# Altium schematic sheet PowerBoard.SchDoc: DriveHUB CardFrame - Backplane Power
size A3; Date: 01/08/22; Engineer: AJC; DocumentNumber: 35-735; Revision: D; SheetNumber: 1; SheetTotal: 3; Manager: AJC
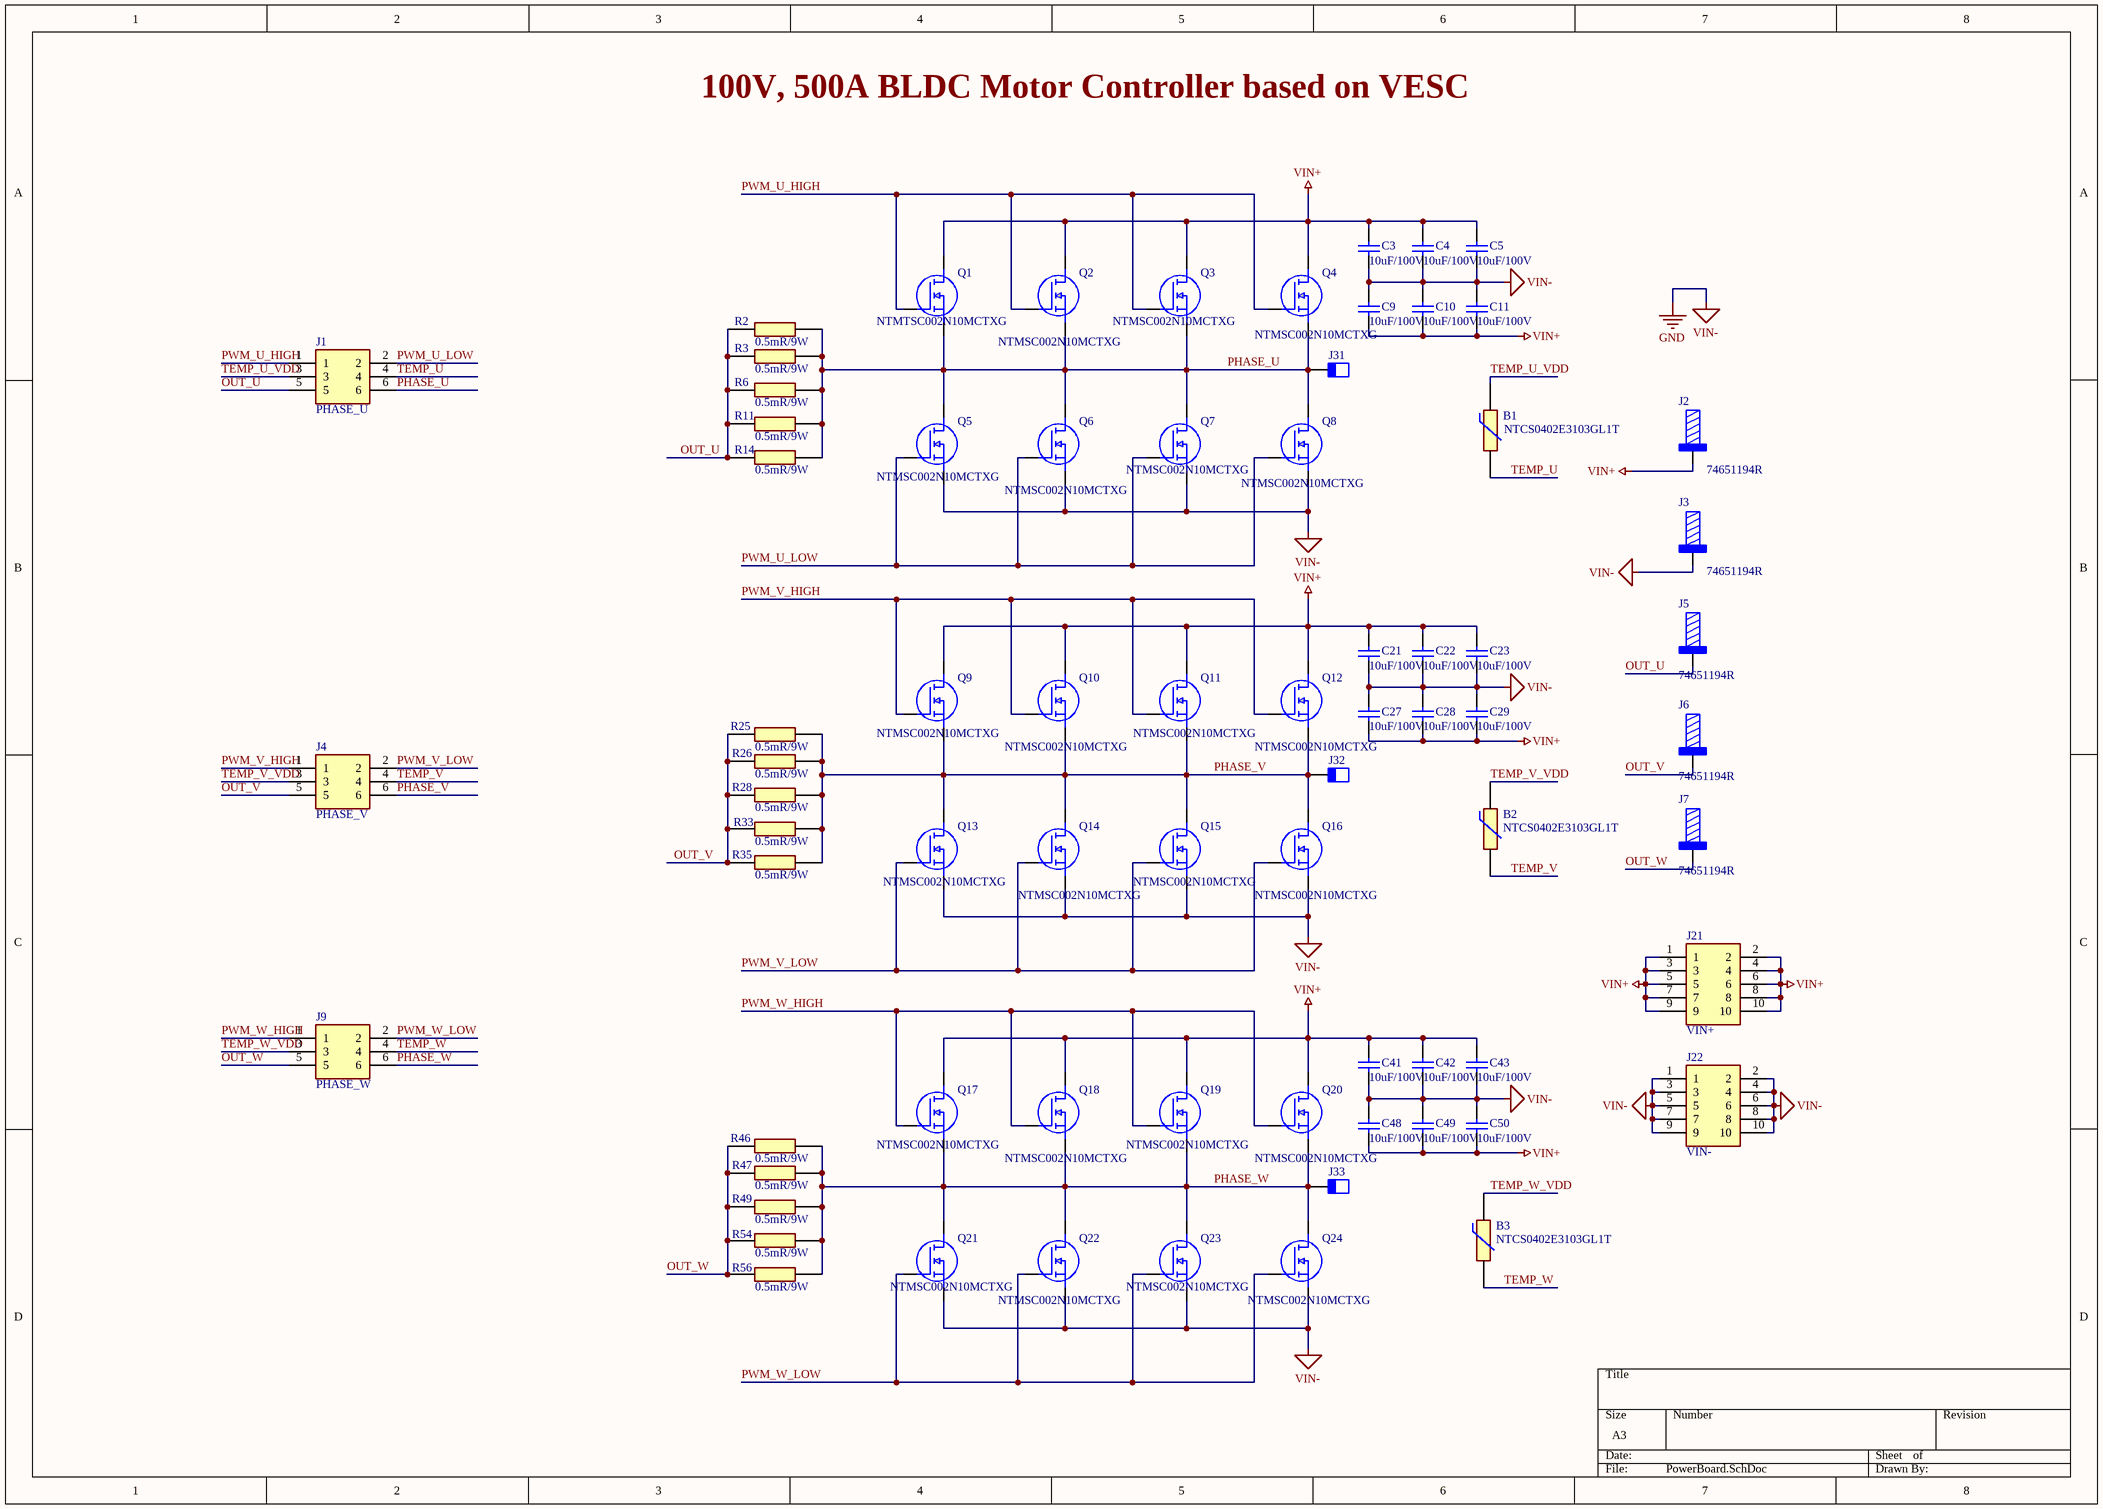
[diagram p0: PowerBoard.SchDoc]

## Parts
B1  NTCS0402E3103GL1T  [THRMC1005X65N]
B2  NTCS0402E3103GL1T  [THRMC1005X65N]
B3  NTCS0402E3103GL1T  [THRMC1005X65N]
C3  10uF/100V  [CAPC3225X230N]
C4  10uF/100V  [CAPC3225X230N]
C5  10uF/100V  [CAPC3225X230N]
C9  10uF/100V  [CAPC3225X230N]
C10  10uF/100V  [CAPC3225X230N]
C11  10uF/100V  [CAPC3225X230N]
C21  10uF/100V  [CAPC3225X230N]
C22  10uF/100V  [CAPC3225X230N]
C23  10uF/100V  [CAPC3225X230N]
C27  10uF/100V  [CAPC3225X230N]
C28  10uF/100V  [CAPC3225X230N]
C29  10uF/100V  [CAPC3225X230N]
C41  10uF/100V  [CAPC3225X230N]
C42  10uF/100V  [CAPC3225X230N]
C43  10uF/100V  [CAPC3225X230N]
C48  10uF/100V  [CAPC3225X230N]
C49  10uF/100V  [CAPC3225X230N]
C50  10uF/100V  [CAPC3225X230N]
J1  PHASE_U  [61030621821]
J2  74651194R  [COPPER_CON1]
J3  74651194R  [COPPER_CON1]
J4  PHASE_V  [61030621821]
J5  74651194R  [COPPER_CON3]
J6  74651194R  [COPPER_CON3]
J7  74651194R  [COPPER_CON3]
J9  PHASE_W  [61030621821]
J21  VIN+  [61031021821]
J22  VIN-  [61031021821]
J31  (no value)  [COPPER_BUS]
J32  (no value)  [COPPER_BUS]
J33  (no value)  [COPPER_BUS]
Q1  NTMTSC002N10MCTXG  [NTMSC002N10MCTXG]
Q2  NTMSC002N10MCTXG  [NTMSC002N10MCTXG]
Q3  NTMSC002N10MCTXG  [NTMSC002N10MCTXG]
Q4  NTMSC002N10MCTXG  [NTMSC002N10MCTXG]
Q5  NTMSC002N10MCTXG  [NTMSC002N10MCTXG]
Q6  NTMSC002N10MCTXG  [NTMSC002N10MCTXG]
Q7  NTMSC002N10MCTXG  [NTMSC002N10MCTXG]
Q8  NTMSC002N10MCTXG  [NTMSC002N10MCTXG]
Q9  NTMSC002N10MCTXG  [NTMSC002N10MCTXG]
Q10  NTMSC002N10MCTXG  [NTMSC002N10MCTXG]
Q11  NTMSC002N10MCTXG  [NTMSC002N10MCTXG]
Q12  NTMSC002N10MCTXG  [NTMSC002N10MCTXG]
Q13  NTMSC002N10MCTXG  [NTMSC002N10MCTXG]
Q14  NTMSC002N10MCTXG  [NTMSC002N10MCTXG]
Q15  NTMSC002N10MCTXG  [NTMSC002N10MCTXG]
Q16  NTMSC002N10MCTXG  [NTMSC002N10MCTXG]
Q17  NTMSC002N10MCTXG  [NTMSC002N10MCTXG]
Q18  NTMSC002N10MCTXG  [NTMSC002N10MCTXG]
Q19  NTMSC002N10MCTXG  [NTMSC002N10MCTXG]
Q20  NTMSC002N10MCTXG  [NTMSC002N10MCTXG]
Q21  NTMSC002N10MCTXG  [NTMSC002N10MCTXG]
Q22  NTMSC002N10MCTXG  [NTMSC002N10MCTXG]
Q23  NTMSC002N10MCTXG  [NTMSC002N10MCTXG]
Q24  NTMSC002N10MCTXG  [NTMSC002N10MCTXG]
R2  0.5mR/9W  [RESC10052X137N]
R3  0.5mR/9W  [RESC10052X137N]
R6  0.5mR/9W  [RESC10052X137N]
R11  0.5mR/9W  [RESC10052X137N]
R14  0.5mR/9W  [RESC10052X137N]
R25  0.5mR/9W  [RESC10052X137N]
R26  0.5mR/9W  [RESC10052X137N]
R28  0.5mR/9W  [RESC10052X137N]
R33  0.5mR/9W  [RESC10052X137N]
R35  0.5mR/9W  [RESC10052X137N]
R46  0.5mR/9W  [RESC10052X137N]
R47  0.5mR/9W  [RESC10052X137N]
R49  0.5mR/9W  [RESC10052X137N]
R54  0.5mR/9W  [RESC10052X137N]
R56  0.5mR/9W  [RESC10052X137N]

## Nets
GND: C3.1 C4.1 C5.1 C9.2 C10.2 C11.2 C21.1 C22.1 C23.1 C27.2 C28.2 C29.2 C41.1 C42.1 C43.1 C48.2 C49.2 C50.2 J3.1 J22.1 J22.2 J22.3 J22.4 J22.5 J22.6 J22.7 J22.8 J22.9 J22.10 Q5.SOURCE Q6.SOURCE Q7.SOURCE Q8.SOURCE Q13.SOURCE Q14.SOURCE Q15.SOURCE Q16.SOURCE Q21.SOURCE Q22.SOURCE Q23.SOURCE Q24.SOURCE  [also labelled VIN-]
VIN+: C3.2 C4.2 C5.2 C9.1 C10.1 C11.1 C21.2 C22.2 C23.2 C27.1 C28.1 C29.1 C41.2 C42.2 C43.2 C48.1 C49.1 C50.1 J2.1 J21.1 J21.2 J21.3 J21.4 J21.5 J21.6 J21.7 J21.8 J21.9 J21.10 Q1.DRAIN Q2.DRAIN Q3.DRAIN Q4.DRAIN Q9.DRAIN Q10.DRAIN Q11.DRAIN Q12.DRAIN Q17.DRAIN Q18.DRAIN Q19.DRAIN Q20.DRAIN
OUT_U: J1.5 J5.1 R2.1 R3.1 R6.1 R11.1 R14.1
OUT_V: J4.5 J6.1 R25.1 R26.1 R28.1 R33.1 R35.1
OUT_W: J7.1 J9.5 R46.1 R47.1 R49.1 R54.1 R56.1
PHASE_U: J1.6 J31.1 Q1.SOURCE Q2.SOURCE Q3.SOURCE Q4.SOURCE Q5.DRAIN Q6.DRAIN Q7.DRAIN Q8.DRAIN R2.2 R3.2 R6.2 R11.2 R14.2
PHASE_V: J4.6 J32.1 Q9.SOURCE Q10.SOURCE Q11.SOURCE Q12.SOURCE Q13.DRAIN Q14.DRAIN Q15.DRAIN Q16.DRAIN R25.2 R26.2 R28.2 R33.2 R35.2
PHASE_W: J9.6 J33.1 Q17.SOURCE Q18.SOURCE Q19.SOURCE Q20.SOURCE Q21.DRAIN Q22.DRAIN Q23.DRAIN Q24.DRAIN R46.2 R47.2 R49.2 R54.2 R56.2
PWM_U_HIGH: J1.1 Q1.GATE Q2.GATE Q3.GATE Q4.GATE
PWM_U_LOW: J1.2 Q5.GATE Q6.GATE Q7.GATE Q8.GATE
PWM_V_HIGH: J4.1 Q9.GATE Q10.GATE Q11.GATE Q12.GATE
PWM_V_LOW: J4.2 Q13.GATE Q14.GATE Q15.GATE Q16.GATE
PWM_W_HIGH: J9.1 Q17.GATE Q18.GATE Q19.GATE Q20.GATE
PWM_W_LOW: J9.2 Q21.GATE Q22.GATE Q23.GATE Q24.GATE
TEMP_U: B1.2 J1.4
TEMP_U_VDD: B1.1 J1.3
TEMP_V: B2.2 J4.4
TEMP_V_VDD: B2.1 J4.3
TEMP_W: B3.2 J9.4
TEMP_W_VDD: B3.1 J9.3

## Notes on the sheet
- 100V, 500A BLDC Motor Controller based on VESC

## Library data of the parts
B1-B3 = NTCS0402E3103GL1T: NTC Thermistors 10Kohms 2% AEC-Q200; Manufacturer: Vishay; Supplier Part Number: 594-NTCS402E3103GL1T; Supplier: Mouser; Manufacturer Part Number: NTCS0402E3103GL1T; Price: 0.47; Value: NTCS0402E3103GL1T
C3-C5 C9-C11 C21-C23 C27-C29 C41-C43 C48-C50 = 10uF ± 10% 100V: Multilayer Ceramic Capacitors MLCC - SMD/SMT 1210 100VDC 10uF 10% X7R; Manufacturer: TDK; Manufacturer Part Number: C3225X7R2A106K250AC; Supplier Part Number: 810-C3225X7R2A106K25; Supplier: Mouser; Price: 1.42; Value: 10uF/100V
J1 J4 J9 = Female Header 6 Pin_1: Headers & Wire Housings WERI Header 2,54 mm SMT; Manufacturer: Wurth Elektronik; Value: 61030621821; Supplier Part Number: 710-61030621821; Supplier: Mouser; Manufacturer Part Number: 61030621821; Price: 1.8
J2 J3 = CopperCon1: WP-THRSH REDCUBE THR with external thread, M4 x 5mm, 85A; Manufacturer: Wurth Elektronik; Surface: Tin; ComponentLink1Description: Website Link; ComponentLink1URL: https://www.we-online.com/redexpert/article/74651194R?ad; ComponentLink2Description: Datasheet Link; ComponentLink2URL: https://www.we-online.com/redexpert/spec/74651194R?ad; Manufacturer Part Number: 74651194R; Category: REDCUBE THR; Match Code: WP-THRSH; Mount: Through Hole Reflow; Operating Temperature Max: 150°C; Operating Temperature Min: -55°C; Packaging: Tape and Reel; Length: 10mm; Width: 10mm; Height: 8.5mm; Material: Brass; Number of Pins: 9; Rated Current: 85A; Thread Length: 5mm; Thread Size: M4; Supplier: Mouser; Supplier Part Number: 710-74651195R; Price: 3.5; Value: 74651194R
J5-J7 = CopperCon3: WP-THRSH REDCUBE THR with external thread, M4 x 5mm, 85A; Manufacturer: Wurth Elektronik; Surface: Tin; ComponentLink1Description: Website Link; ComponentLink1URL: https://www.we-online.com/redexpert/article/74651194R?ad; ComponentLink2Description: Datasheet Link; ComponentLink2URL: https://www.we-online.com/redexpert/spec/74651194R?ad; Manufacturer Part Number: 74651194R; Category: REDCUBE THR; Match Code: WP-THRSH; Mount: Through Hole Reflow; Operating Temperature Max: 150°C; Operating Temperature Min: -55°C; Packaging: Tape and Reel; Length: 10mm; Width: 10mm; Height: 8.5mm; Material: Brass; Number of Pins: 9; Rated Current: 85A; Thread Length: 5mm; Thread Size: M4; Supplier: Mouser; Supplier Part Number: 710-74651195R; Price: 3.5; Value: 74651194R
J21 J22 = Female Header 10 Pin_1: Headers & Wire Housings WR-PHD 250VAC 3A Gry 2Row 10Pos Strgt; Manufacturer: Wurth Elektronik; Value: 61031021821; Supplier Part Number: 710-61031021821; Supplier: Mouser; Manufacturer Part Number: 61031021821; Price: 2
J31-J33 = CopperBus: WP-THRSH REDCUBE THR with external thread, M4 x 5mm, 85A; Manufacturer Part Number: 74651194R; Manufacturer: Wurth Elektronik; Surface: Tin; Value: 74651194R; ComponentLink1Description: Website Link; ComponentLink1URL: https://www.we-online.com/redexpert/article/74651194R?ad; ComponentLink2Description: Datasheet Link; ComponentLink2URL: https://www.we-online.com/redexpert/spec/74651194R?ad; Category: REDCUBE THR; Match Code: WP-THRSH; Mount: Through Hole Reflow; Operating Temperature Max: 150°C; Operating Temperature Min: -55°C; Packaging: Tape and Reel; Length: 10mm; Width: 10mm; Height: 8.5mm; Material: Brass; Number of Pins: 9; Rated Current: 85A; Thread Length: 5mm; Thread Size: M4; Supplier: Mouser; Supplier Part Number: 710-74651195R; Price: 3.5
Q1 = NTMSC002N10MCTXG: MOSFET Single N-Channel Power MOSFET 100V, 236A, 2.0mohm; Manufacturer: Onsemi; Supplier Part Number: 863-TMTSC002N10MCTXG; Supplier: Mouser; Manufacturer Part Number: NTMTSC002N10MCTXG; Price: 5.9; Value: NTMTSC002N10MCTXG
Q2-Q24 = NTMSC002N10MCTXG: MOSFET Single N-Channel Power MOSFET 100V, 236A, 2.0mohm; Manufacturer: Onsemi; Manufacturer Part Number: NTMTSC002N10MCTXG; Supplier Part Number: 863-TMTSC002N10MCTXG; Supplier: Mouser; Price: 5.9; Value: NTMSC002N10MCTXG
R2 R3 R6 R11 R14 R25 R26 R28 R33 R35 R46 R47 R49 R54 R56 = CSS2H-3920R-L500FE: Current Sense Resistors - SMD 0.5mOHMS 9W 1% AEC-Q200; Manufacturer: Bourns; Value: 0.5ohm 9W; Supplier Part Number: 652-CSS2H3920RL500FE; Supplier: Mouser; Manufacturer Part Number: CSS2H-3920R-L500FE; Price: 2